# Altium schematic sheet clone_Schematics.SchDoc (part 2 of 2)
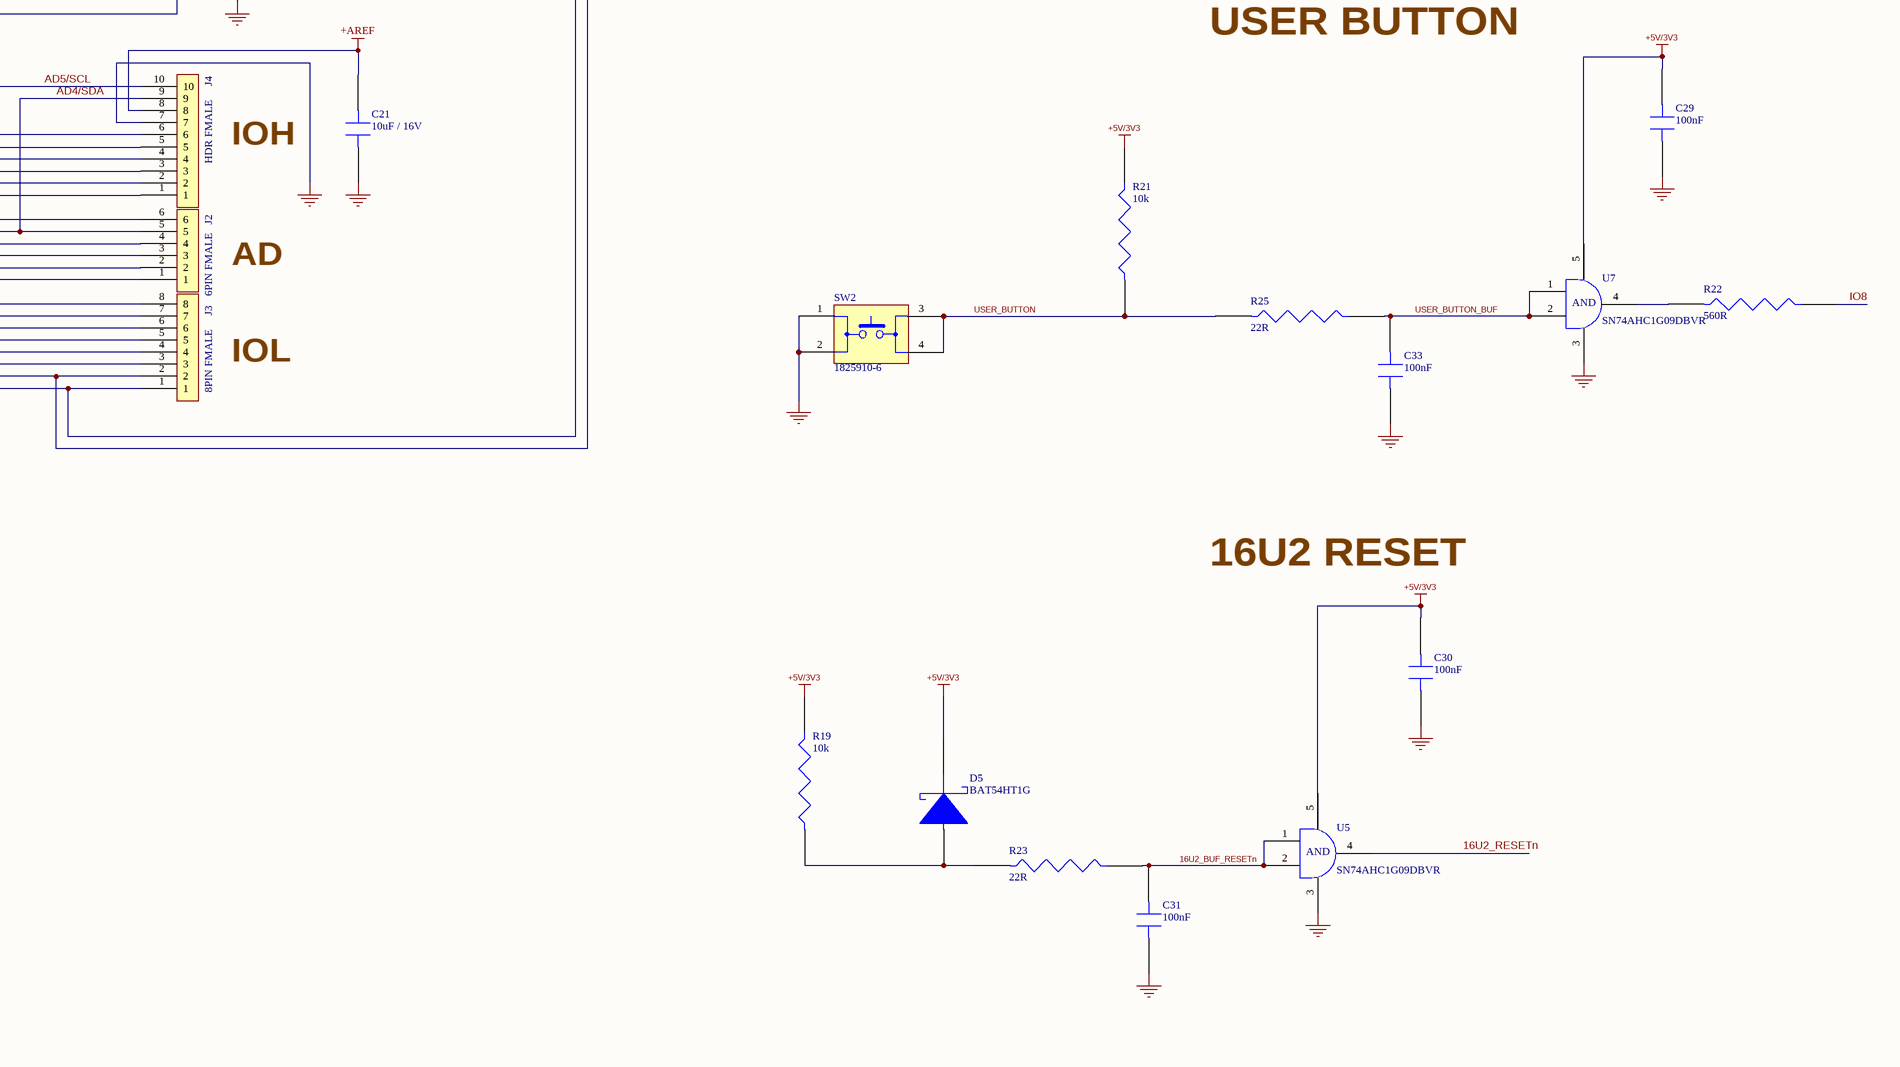
[diagram p4: clone_Schematics.SchDoc, bottom right]

## Library data of the parts
C1 C2 = EEE-1AA101WR: Aluminum Electrolytic Capacitor, 100 uF, 10 V, ± 20%, 1000 hours @ 85°C, Radial Can - SMD; Manufacturer: Panasonic; Capacitance: 100uF; Ripple Current: 50mA; Dissipation Factor: 30%; Leakage Current: 10uA; Supplier 1: Future Electronics; Manufacturer Part Number: EEE-1AA101WR; RoHS: Yes; Category: Aluminum Electrolytic Capacitors; Stock 1: 224000; Pricing 1: 1000=0.0636, 3000=0.062, 5000=0.0612, 20000=0.0592, 30000=0.0579 (USD); Mount: Surface Mount,PCB; Case/Package: Radial; Min Operating Temperature: -40°C; Max Operating Temperature: 85°C; Voltage Rating: 10V; Tolerance: 20%; Packaging: Tape and Reel; Package Quantity: 1000; Ripple Current (AC): 50mA; Voltage Rating (DC): 10V; Termination: SMD/SMT; Life (Hours): 1000Hour; Series: S; Construction: Cylindrical; Diameter: 5mm; Length: 5.5mm; Height: 5.4mm; Ratings: AEC-Q200; Radiation Hardening: No; Lead Free: Lead Free; RoHS Compliant: Yes; Reach SVHC Compliant: Unknown; ComponentLink1URL: https://datasheet.ciiva.com/26945/getdatasheetpartid-169213-26945071.pdf?src-supplier=Verical; ComponentLink1Description: https://datasheet.ciiva.com/26945/getdatasheetpartid-169213-26945071.pdf?src-supplier=Verical; ComponentLink2URL: https://datasheet.ciiva.com/24027/aba0000ce2-40801-24027541.pdf?src-supplier=Mouser; ComponentLink2Description: https://datasheet.ciiva.com/24027/aba0000ce2-40801-24027541.pdf?src-supplier=Mouser; ComponentLink3URL: https://datasheet.ciiva.com/14598/70255710-14598233.pdf?src-supplier=Allied+Electronics; ComponentLink3Description: https://datasheet.ciiva.com/14598/70255710-14598233.pdf?src-supplier=Allied+Electronics; ComponentLink4URL: https://datasheet.ciiva.com/14605/70255710-14605689.pdf?src-supplier=Allied+Electronics; ComponentLink4Description: https://datasheet.ciiva.com/14605/70255710-14605689.pdf?src-supplier=Allied+Electronics; ComponentLink5URL: https://datasheet.ciiva.com/11673/aba0000ce2-11673882.pdf?src-supplier=Avnet; ComponentLink5Description: https://datasheet.ciiva.com/11673/aba0000ce2-11673882.pdf?src-supplier=Avnet; ComponentLink6URL: https://datasheet.ciiva.com/16427/aba0000ce2-16427544.pdf?src-supplier=Future+Electronics; ComponentLink6Description: https://datasheet.ciiva.com/16427/aba0000ce2-16427544.pdf?src-supplier=Future+Electronics; Supplier Part Number 1: 4028584
C3 C12 C13 C19 C21 C22 C34 = CAP2
C4-C6 C8 C11 C14-C17 C20 C23 C24 C26 C28-C33 = C2012X7R1H104K085AA: Multilayer Ceramic Capacitor, 0.1 uF, 50 V, ± 10%, X7R, 0805 [2012 Metric]; Manufacturer: TDK; Voltage Rating: 50V; Supplier 1: Digikey; Manufacturer Part Number: C2012X7R1H104K085AA; RoHS: Yes; Category: Ceramic Capacitors; Stock 1: 1434801; Pricing 1: 1=0.13, 10=0.071, 50=0.0492, 100=0.0424, 500=0.03106, 1000=0.02754 (USD); Mount: Surface Mount; Case/Package: 0805; Number of Pins: 2; Case Code (Metric): 2012; Case Code (Imperial): 0805; Min Operating Temperature: -55°C; Max Operating Temperature: 125°C; Capacitance: 100nF; Tolerance: 10%; Packaging: Tape and Reel; Dielectric: X7R; Package Quantity: 1; Termination: SMD/SMT; Voltage: 50V; Series: C; Length: 2mm; Width: 0.049inch; Height: 0.85mm; Depth: 1.25mm; Thickness: 0.037inch; RoHS Compliant: Yes; Reach SVHC Compliant: No; Lead Free: Lead Free; ComponentLink1URL: https://datasheet.ciiva.com/11788/0900766b80c1bb00-11788128.pdf?src-supplier=Rs; ComponentLink1Description: https://datasheet.ciiva.com/11788/0900766b80c1bb00-11788128.pdf?src-supplier=Rs; ComponentLink2URL: https://datasheet.ciiva.com/6250/tdkmlcccaprange-6250821.pdf?src-supplier=Digikey; ComponentLink2Description: https://datasheet.ciiva.com/6250/tdkmlcccaprange-6250821.pdf?src-supplier=Digikey; ComponentLink3URL: https://datasheet.ciiva.com/6250/tdkmlcccaprange-6250824.pdf?src-supplier=Digikey; ComponentLink3Description: https://datasheet.ciiva.com/6250/tdkmlcccaprange-6250824.pdf?src-supplier=Digikey; ComponentLink4URL: https://datasheet.ciiva.com/23803/1796654-23803035.pdf?src-supplier=Newark; ComponentLink4Description: https://datasheet.ciiva.com/23803/1796654-23803035.pdf?src-supplier=Newark; ComponentLink5URL: https://datasheet.ciiva.com/28602/1571323-28602204.pdf?src-supplier=Element14; ComponentLink5Description: https://datasheet.ciiva.com/28602/1571323-28602204.pdf?src-supplier=Element14; ComponentLink6URL: https://datasheet.ciiva.com/24191/e412-c-24191447.pdf?src-supplier=Future+Electronics; ComponentLink6Description: https://datasheet.ciiva.com/24191/e412-c-24191447.pdf?src-supplier=Future+Electronics; Supplier Part Number 1: 445-7534-1-ND
C7 = C2012X5R1E105K125AA: CAP CER 1UF 25V X5R 0805; Manufacturer: TDK; Supplier 1: Rs; Manufacturer Part Number: C2012X5R1E105K125AA; RoHS: Yes; Category: Ceramic Capacitors; Stock 1: 1850; ComponentLink1URL: https://datasheet.ciiva.com/11787/0900766b80c1bb00-11787608.pdf?src-supplier=Rs; ComponentLink1Description: https://datasheet.ciiva.com/11787/0900766b80c1bb00-11787608.pdf?src-supplier=Rs; ComponentLink2URL: https://datasheet.ciiva.com/16449/e412-c-16449595.pdf?src-supplier=Future+Electronics; ComponentLink2Description: https://datasheet.ciiva.com/16449/e412-c-16449595.pdf?src-supplier=Future+Electronics; ComponentLink3URL: https://datasheet.ciiva.com/15192/getdatasheetpartid-726707-15192140.pdf?src-supplier=Verical; ComponentLink3Description: https://datasheet.ciiva.com/15192/getdatasheetpartid-726707-15192140.pdf?src-supplier=Verical; ComponentLink4URL: https://datasheet.ciiva.com/28602/1744655-28602171.pdf?src-supplier=Element14; ComponentLink4Description: https://datasheet.ciiva.com/28602/1744655-28602171.pdf?src-supplier=Element14; Supplier Part Number 1: 2427392P
C9 C10 C25 C27 = C0805C180J5TACTU: Cap Cer 0805 18PF 50VDC X8G 5%; Manufacturer: KEMET; Supplier 1: Digikey; Manufacturer Part Number: C0805C180J5TACTU; RoHS: Yes; Pricing 1: 16000=0.01394 (USD); RoHS Compliant: 5897YesNo; Supplier Part Number 1: 399-C0805C180J5TACTUTR-ND
D1 = LGL29K-G2J1-24-Z: LED Uni-Color Green 572nm Automotive 2-Pin Chip 0603(1608Metric) T/R; Manufacturer: Osram Opto; Lens Color: White; Forward Current: 20mA; Forward Voltage: 2.2V; Luminous Intensity: 5.6mcd; Viewing Angle: 160°; Lens Style: Flat,Diffused,Colorless,Rectangular; Test Current: 2mA; Dominant Wavelength: 570nm; Luminous Flux: 0.012lm; Number of LEDs: 1; Lens Transparency: Diffused; Reverse Voltage: 12V; Lens Size: 0.8mm; Supplier 1: Arrow Electronics; Manufacturer Part Number: LGL29K-G2J1-24-Z; RoHS: Yes; Category: LEDs; Stock 1: 160000; Pricing 1: 5000=0.0794, 10000=0.0725, 20000=0.0718, 25000=0.0689, 30000=0.0669, 50000=0.0624 (USD); Mount: Surface Mount; Case/Package: 0603; Number of Pins: 2; Color: Green; Case Code (Metric): 1608; Case Code (Imperial): 0603; Min Operating Temperature: -40°C; Max Operating Temperature: 100°C; Illumination Color: Green; Packaging: Tape and Reel; Package Quantity: 5000; Number of Elements: 1; Series: SMARTLED® 0603; Length: 1.3mm; Width: 0.8mm; Height: 0.65mm; Depth: 0.8mm; Radiation Hardening: No; RoHS Compliant: Yes; ComponentLink1URL: https://datasheet.ciiva.com/4689/g-l29k-39844-4689584.pdf?src-supplier=Mouser; ComponentLink1Description: https://datasheet.ciiva.com/4689/g-l29k-39844-4689584.pdf?src-supplier=Mouser; ComponentLink2URL: https://datasheet.ciiva.com/2112/00077107-0-2112887.pdf?src-supplier=Digikey; ComponentLink2Description: https://datasheet.ciiva.com/2112/00077107-0-2112887.pdf?src-supplier=Digikey; ComponentLink3URL: https://datasheet.ciiva.com/2112/00077107-0-2112886.pdf?src-supplier=Digikey; ComponentLink3Description: https://datasheet.ciiva.com/2112/00077107-0-2112886.pdf?src-supplier=Digikey; ComponentLink4URL: https://datasheet.ciiva.com/2112/00077107-0-2112888.pdf?src-supplier=Digikey; ComponentLink4Description: https://datasheet.ciiva.com/2112/00077107-0-2112888.pdf?src-supplier=Digikey; Supplier Part Number 1: LGL29K-G2J1-24-Z
D2-D4 = LED
D5 D6 = BAT54HT1G: Small Signal Schottky Diode, Single, 30 V, 200 Ma, 800 Mv, 600 Ma, 150 C; Manufacturer: ON Semiconductor / Fairchild; Forward Current: 200mA; Max Reverse Current: 2uA; Recovery Time: 5ns; Max Repetitive Reverse Voltage (Vrrm): 30V; Peak Non-Repetitive Surge Current: 600mA; Forward Voltage: 800mV; Power Dissipation: 200mW; Capacitance: 10pF; Polarity: 4901Direction; Supplier 1: Rs; Manufacturer Part Number: BAT54HT1G; RoHS: Yes; Category: Schottky Diodes; Stock 1: 15630; Mount: Surface Mount; Number of Pins: 2; Contact Plating: Tin,Matte; Min Operating Temperature: -55°C; Max Operating Temperature: 150°C; Packaging: Tape and Reel; Package Quantity: 1; Average Rectified Current: 200mA; Reverse Recovery Time: 5ns; Max Forward Surge Current (Ifsm): 600mA; Max Reverse Voltage (DC): 30V; Reverse Voltage: 30V; Series: -; Max Surge Current: 600mA; Voltage Rating (DC): 30V; Current Rating: 200mA; Max Reverse Leakage Current: 2uA; Reverse Recovery Time-Max: 5ns; Breakdown Voltage: 30V; Output Current: 200mA; Length: 1.8mm; Width: 1.35mm; Height: 1mm; Radiation Hardening: No; RoHS Compliant: Yes; Reach SVHC Compliant: No; Lead Free: Lead Free; ComponentLink1URL: https://datasheet.ciiva.com/4714/bat54ht1-d-72881-4714706.pdf?src-supplier=Mouser; ComponentLink1Description: https://datasheet.ciiva.com/4714/bat54ht1-d-72881-4714706.pdf?src-supplier=Mouser; ComponentLink2URL: https://datasheet.ciiva.com/4452/bat54ht1g-104602-4452889.pdf?src-supplier=Mouser; ComponentLink2Description: https://datasheet.ciiva.com/4452/bat54ht1g-104602-4452889.pdf?src-supplier=Mouser; ComponentLink3URL: https://datasheet.ciiva.com/30479/0900766b811a63a9-30479442.pdf?src-supplier=Rs; ComponentLink3Description: https://datasheet.ciiva.com/30479/0900766b811a63a9-30479442.pdf?src-supplier=Rs; ComponentLink4URL: https://datasheet.ciiva.com/34301/806549-34301562.pdf?src-supplier=Jameco; ComponentLink4Description: https://datasheet.ciiva.com/34301/806549-34301562.pdf?src-supplier=Jameco; ComponentLink5URL: https://datasheet.ciiva.com/1240/1747983-1240762.pdf?src-supplier=Newark; ComponentLink5Description: https://datasheet.ciiva.com/1240/1747983-1240762.pdf?src-supplier=Newark; ComponentLink6URL: https://datasheet.ciiva.com/915/bat54ht1-d-915445.pdf?src-supplier=Digikey; ComponentLink6Description: https://datasheet.ciiva.com/915/bat54ht1-d-915445.pdf?src-supplier=Digikey; ComponentLink7URL: https://datasheet.ciiva.com/915/bat54ht1-d-915444.pdf?src-supplier=Digikey; ComponentLink7Description: https://datasheet.ciiva.com/915/bat54ht1-d-915444.pdf?src-supplier=Digikey; ComponentLink8URL: https://datasheet.ciiva.com/910/bat54ht1g-910499.pdf?src-supplier=Digikey; ComponentLink8Description: https://datasheet.ciiva.com/910/bat54ht1g-910499.pdf?src-supplier=Digikey; ComponentLink9URL: https://datasheet.ciiva.com/910/bat54ht1g-910498.pdf?src-supplier=Digikey; ComponentLink9Description: https://datasheet.ciiva.com/910/bat54ht1g-910498.pdf?src-supplier=Digikey; ComponentLink10URL: https://datasheet.ciiva.com/8294/bat54ht1-d-8294645.pdf?src-supplier=Avnet; ComponentLink10Description: https://datasheet.ciiva.com/8294/bat54ht1-d-8294645.pdf?src-supplier=Avnet; ComponentLink11URL: https://datasheet.ciiva.com/910/bat54ht1g-910497.pdf?src-supplier=Digikey; ComponentLink11Description: https://datasheet.ciiva.com/910/bat54ht1g-910497.pdf?src-supplier=Digikey; ComponentLink12URL: https://datasheet.ciiva.com/8303/bat54ht1g-8303645.pdf?src-supplier=Avnet; ComponentLink12Description: https://datasheet.ciiva.com/8303/bat54ht1g-8303645.pdf?src-supplier=Avnet; ComponentLink13URL: https://datasheet.ciiva.com/915/bat54ht1-d-915443.pdf?src-supplier=Digikey; ComponentLink13Description: https://datasheet.ciiva.com/915/bat54ht1-d-915443.pdf?src-supplier=Digikey; ComponentLink14URL: https://datasheet.ciiva.com/46429/1727620-46429206.pdf?src-supplier=Element14; ComponentLink14Description: https://datasheet.ciiva.com/46429/1727620-46429206.pdf?src-supplier=Element14; ComponentLink15URL: https://datasheet.ciiva.com/1180/bat54ht1-d-1180252.pdf?src-supplier=Element14; ComponentLink15Description: https://datasheet.ciiva.com/1180/bat54ht1-d-1180252.pdf?src-supplier=Element14; ComponentLink16URL: https://datasheet.ciiva.com/1180/bat54ht1-d-1180251.pdf?src-supplier=Element14; ComponentLink16Description: https://datasheet.ciiva.com/1180/bat54ht1-d-1180251.pdf?src-supplier=Element14; ComponentLink17URL: https://datasheet.ciiva.com/17020/bat54ht1g-17020445.pdf?src-supplier=Future+Electronics; ComponentLink17Description: https://datasheet.ciiva.com/17020/bat54ht1g-17020445.pdf?src-supplier=Future+Electronics; ComponentLink18URL: https://datasheet.ciiva.com/48686/001262925-da-01-en-diode-schottky-30v-bat54ht1g-sod-323-fsc-48686266.pdf?src-supplier=Conrad; ComponentLink18Description: https://datasheet.ciiva.com/48686/001262925-da-01-en-diode-schottky-30v-bat54ht1g-sod-323-fsc-48686266.pdf?src-supplier=Conrad; Supplier Part Number 1: 7737614P
FB1-FB3 = MPZ2012S601AT000: Ferrite Beads Multi-Layer Power 600Ohm 25% 100MHz 2A 100mOhm DCR 0805 T/R; Manufacturer: TDK; Core Material: 228ConductorMaterial; Impedance: 600R; DC Resistance (DCR): 100mR; Number of Lines: 1; Supplier 1: Digikey; Manufacturer Part Number: MPZ2012S601AT000; RoHS: Yes; Category: Ferrite Beads and Chips; Stock 1: 207332; Pricing 1: 1=0.12, 10=0.094, 25=0.0848, 50=0.0622, 100=0.0537, 250=0.0424, 500=0.03582, 1000=0.03016, 4000=0.02827, 8000=0.02639, 12000=0.0245, 28000=0.02422, 100000=0.02356 (USD); Mount: Surface Mount; Case/Package: 0805; Case Code (Metric): 2012; Case Code (Imperial): 0805; Min Operating Temperature: -55°C; Max Operating Temperature: 125°C; Packaging: Tape and Reel; Package Quantity: 1; Current Rating: 2A; Max DC Current: 2A; Series: MPZ; Max Current Rating: 2A; RMS Current (Irms): 2A; Series Resistance: 100mR; Test Frequency: 100MHz; Tolerance: 25%; Length: 0.079inch; Width: 0.049inch; Height: 0.041inch; Reach SVHC Compliant: No; Lead Free: Lead Free; RoHS Compliant: Yes; ComponentLink1URL: https://datasheet.ciiva.com/46634/beads-commercial-power-mpz-en-46634335.pdf?src-supplier=Digikey; ComponentLink1Description: https://datasheet.ciiva.com/46634/beads-commercial-power-mpz-en-46634335.pdf?src-supplier=Digikey; ComponentLink2URL: https://datasheet.ciiva.com/46634/beads-commercial-power-mpz-en-46634377.pdf?src-supplier=Digikey; ComponentLink2Description: https://datasheet.ciiva.com/46634/beads-commercial-power-mpz-en-46634377.pdf?src-supplier=Digikey; ComponentLink3URL: https://datasheet.ciiva.com/46634/beads-commercial-power-mpz-en-46634606.pdf?src-supplier=Digikey; ComponentLink3Description: https://datasheet.ciiva.com/46634/beads-commercial-power-mpz-en-46634606.pdf?src-supplier=Digikey; Supplier Part Number 1: 445-MPZ2012S601AT000CT-ND
J1 J3 = 8PIN
J2 = 6PIN
J4 = 10PIN
J5 J6 = 67997-106HLF: Conn Unshrouded Header HDR 6 POS 2.54mm Solder ST Top Entry Thru-Hole BergStik® Bulk; Manufacturer: Amphenol ICC / FCI; Supplier 1: Arrow Electronics; Manufacturer Part Number: 67997-106HLF; RoHS: No; Category: Headers and Wire Housings; Stock 1: 1120; Pricing 1: 1=0.6738 (USD); ComponentLink1URL: http://uk.rs-online.com/webdocs/1450/0900766b81450b8b.pdf?src-supplier=Rs; ComponentLink1Description: http://uk.rs-online.com/webdocs/1450/0900766b81450b8b.pdf?src-supplier=Rs; ComponentLink2URL: https://datasheet.octopart.com/67997-106HLF-Areva-datasheet-118652.pdf?src-supplier=Digikey; ComponentLink2Description: https://datasheet.octopart.com/67997-106HLF-Areva-datasheet-118652.pdf?src-supplier=Digikey; ComponentLink3URL: https://datasheet.octopart.com/67997-106HLF-Amphenol-Communications-Solutions-datasheet-36854132.pdf?src-supplier=Farnell; ComponentLink3Description: https://datasheet.octopart.com/67997-106HLF-Amphenol-Communications-Solutions-datasheet-36854132.pdf?src-supplier=Farnell; ComponentLink4URL: https://cdn.amphenol-icc.com/media/wysiwyg/files/drawing/67996.pdf?src-supplier=Mouser; ComponentLink4Description: https://cdn.amphenol-icc.com/media/wysiwyg/files/drawing/67996.pdf?src-supplier=Mouser; ComponentLink5URL: https://cdn.amphenol-icc.com/media/wysiwyg/files/drawing/67996.pdf?src-supplier=Avnet; ComponentLink5Description: https://cdn.amphenol-icc.com/media/wysiwyg/files/drawing/67996.pdf?src-supplier=Avnet; ComponentLink6URL: http://components.arrow.com/part/dataview/41913658S7633350N8314?src-supplier=Arrow+Electronics; ComponentLink6Description: http://components.arrow.com/part/dataview/41913658S7633350N8314?src-supplier=Arrow+Electronics; ComponentLink7URL: https://cdn.amphenol-icc.com/media/wysiwyg/files/drawing/67996.pdf?src-supplier=Onlinecomponents.com; ComponentLink7Description: https://cdn.amphenol-icc.com/media/wysiwyg/files/drawing/67996.pdf?src-supplier=Onlinecomponents.com; ComponentLink8URL: http://www.farnell.com/datasheets/1876884.pdf?src-supplier=Newark; ComponentLink8Description: http://www.farnell.com/datasheets/1876884.pdf?src-supplier=Newark; ComponentLink9URL: https://cdn.amphenol-icc.com/media/wysiwyg/files/drawing/67996.pdf?src-supplier=Allied+Electronics; ComponentLink9Description: https://cdn.amphenol-icc.com/media/wysiwyg/files/drawing/67996.pdf?src-supplier=Allied+Electronics; ComponentLink10URL: https://cdn.amphenol-icc.com/media/wysiwyg/files/drawing/67996.pdf?src-supplier=TTI; ComponentLink10Description: https://cdn.amphenol-icc.com/media/wysiwyg/files/drawing/67996.pdf?src-supplier=TTI; ComponentLink11URL: https://cdn.amphenol-icc.com/media/wysiwyg/files/drawing/67996.pdf?src-supplier=Heilind+Electronics; ComponentLink11Description: https://cdn.amphenol-icc.com/media/wysiwyg/files/drawing/67996.pdf?src-supplier=Heilind+Electronics; Supplier Part Number 1: 67997-106HLF
J7 = 101181930001LF: MICRO USB B0TYPE F-10118193-0001LF | Amphenol FCI (Amphenol CS) 101181930001LF; Manufacturer: Amphenol Communications Solutions; Supplier 1: Digikey; Manufacturer Part Number: 101181930001LF; RoHS: No; Category: Uncategorized; Stock 1: 190276; Pricing 1: 1=0.57, 10=0.43, 25=0.3864, 50=0.3566, 100=0.3293, 250=0.29696, 500=0.27504, 1200=0.24879, 2400=0.2326, 3600=0.22308, 6000=0.21184, 8400=0.20487, 12000=0.19785, 30000=0.18138 (USD); Supplier Part Number 1: 609-4616-1-ND
J8 J9 = PAD_WITH_HOLE: pad with hole
JP1 JP4 = 68000-103HLF: Conn Unshrouded Header HDR 3 POS 2.54mm Solder ST Top Entry Thru-Hole BergStik® Automotive Bulk; Manufacturer: Amphenol ICC / FCI; Supplier 1: Arrow Electronics; Manufacturer Part Number: 68000-103HLF; RoHS: No; Category: Headers and Wire Housings; Stock 1: 30; Pricing 1: 1=0.3226, 10=0.2231, 25=0.2208, 50=0.1898, 100=0.1562, 1000=0.1333 (USD); ComponentLink1URL: https://datasheet.ciiva.com/46392/1914865-46392021.pdf?src-supplier=Element14; ComponentLink1Description: https://datasheet.ciiva.com/46392/1914865-46392021.pdf?src-supplier=Element14; Supplier Part Number 1: 68000-103HLF
JP2 = 68602-204HLF: Conn Unshrouded Header HDR 4 POS 2.54mm Solder ST Top Entry Thru-Hole BergStik® Bulk; Manufacturer: Amphenol ICC / FCI; Number of Positions: 4; Current Rating: 3A; Insulation Resistance: 5GR; Voltage Rating: 1.5kV; Row Spacing: 0.1inch; Contact Post Length: 3.81mm; Supplier 1: Arrow Electronics; Manufacturer Part Number: 68602-204HLF; RoHS: No; Category: Connectors; Pricing 1: 2000=0.1295, 2500=0.1283, 3000=0.1271, 4000=0.1259, 5000=0.1247, 6000=0.1235, 10000=0.1223, 20000=0.121, 50000=0.1198 (USD); Mount: Through Hole; Contact Plating: Gold,GXT; Color: Black; Contact Material: Bronze; Housing Material: Thermoplastic; Min Operating Temperature: -65°C; Max Operating Temperature: 125°C; Series: BERGSTIK® II, MezzSelect™, Basics+; Packaging: Bulk; Contact Type: Male Pin; Number of Rows: 2; Termination: Solder; Contact Gender: Male; Package Quantity: 100; Number of Contacts: 4; Pitch: 2.54mm; Contact Mating Length: 0.23inch; Radiation Hardening: No; Flammability Rating: UL94 V-0; ComponentLink1URL: https://cdn.amphenol-icc.com/media/wysiwyg/files/drawing/67996.pdf?src-supplier=Digikey; ComponentLink1Description: https://cdn.amphenol-icc.com/media/wysiwyg/files/drawing/67996.pdf?src-supplier=Digikey; ComponentLink2URL: https://cdn.amphenol-icc.com/media/wysiwyg/files/drawing/67996.pdf?src-supplier=Allied+Electronics; ComponentLink2Description: https://cdn.amphenol-icc.com/media/wysiwyg/files/drawing/67996.pdf?src-supplier=Allied+Electronics; ComponentLink3URL: https://cdn.amphenol-icc.com/media/wysiwyg/files/drawing/67996.pdf?src-supplier=Mouser; ComponentLink3Description: https://cdn.amphenol-icc.com/media/wysiwyg/files/drawing/67996.pdf?src-supplier=Mouser; ComponentLink4URL: https://cdn.amphenol-icc.com/media/wysiwyg/files/drawing/67996.pdf?src-supplier=Avnet; ComponentLink4Description: https://cdn.amphenol-icc.com/media/wysiwyg/files/drawing/67996.pdf?src-supplier=Avnet; ComponentLink5URL: https://cdn.amphenol-icc.com/media/wysiwyg/files/drawing/67996.pdf?src-supplier=Heilind+Electronics; ComponentLink5Description: https://cdn.amphenol-icc.com/media/wysiwyg/files/drawing/67996.pdf?src-supplier=Heilind+Electronics; Supplier Part Number 1: 68602-204HLF
JP3 = 68001-204HLF: Conn Unshrouded Header HDR 4 POS 2.54mm Solder ST Thru-Hole Bag; Manufacturer: Amphenol ICC / FCI; Supplier 1: Digikey; Manufacturer Part Number: 68001-204HLF; RoHS: No; Category: Headers and Wire Housings; Stock 1: 3967; Pricing 1: 1=0.51, 10=0.388, 100=0.2643, 500=0.24106, 1000=0.19734, 5000=0.17678, 10000=0.17484 (USD); ComponentLink1URL: http://uk.rs-online.com/webdocs/1450/0900766b81450c68.pdf?src-supplier=Rs; ComponentLink1Description: http://uk.rs-online.com/webdocs/1450/0900766b81450c68.pdf?src-supplier=Rs; ComponentLink2URL: https://datasheet.octopart.com/68001-204HLF-Amphenol-Communications-Solutions-datasheet-100449246.pdf?src-supplier=Future+Electronics; ComponentLink2Description: https://datasheet.octopart.com/68001-204HLF-Amphenol-Communications-Solutions-datasheet-100449246.pdf?src-supplier=Future+Electronics; ComponentLink3URL: http://components.arrow.com/part/dataview/42735081S8853857N8314?src-supplier=Arrow+Electronics; ComponentLink3Description: http://components.arrow.com/part/dataview/42735081S8853857N8314?src-supplier=Arrow+Electronics; ComponentLink4URL: https://cdn.amphenol-icc.com/media/wysiwyg/files/drawing/68000.pdf?src-supplier=Digikey; ComponentLink4Description: https://cdn.amphenol-icc.com/media/wysiwyg/files/drawing/68000.pdf?src-supplier=Digikey; ComponentLink5URL: https://cdn.amphenol-icc.com/media/wysiwyg/files/drawing/68000.pdf?src-supplier=Mouser; ComponentLink5Description: https://cdn.amphenol-icc.com/media/wysiwyg/files/drawing/68000.pdf?src-supplier=Mouser; ComponentLink6URL: https://datasheet.octopart.com/68001-204HLF-Amphenol-Communications-Solutions-datasheet-41232361.pdf?src-supplier=Element14; ComponentLink6Description: https://datasheet.octopart.com/68001-204HLF-Amphenol-Communications-Solutions-datasheet-41232361.pdf?src-supplier=Element14; ComponentLink7URL: https://cdn.amphenol-icc.com/media/wysiwyg/files/drawing/68000.pdf?src-supplier=Allied+Electronics; ComponentLink7Description: https://cdn.amphenol-icc.com/media/wysiwyg/files/drawing/68000.pdf?src-supplier=Allied+Electronics; ComponentLink8URL: https://cdn.amphenol-icc.com/media/wysiwyg/files/drawing/68000.pdf?src-supplier=Avnet; ComponentLink8Description: https://cdn.amphenol-icc.com/media/wysiwyg/files/drawing/68000.pdf?src-supplier=Avnet; ComponentLink9URL: https://cdn.amphenol-icc.com/media/wysiwyg/files/drawing/68000.pdf?src-supplier=TTI; ComponentLink9Description: https://cdn.amphenol-icc.com/media/wysiwyg/files/drawing/68000.pdf?src-supplier=TTI; ComponentLink10URL: https://cdn.amphenol-icc.com/media/wysiwyg/files/drawing/68000.pdf?src-supplier=Heilind+Electronics; ComponentLink10Description: https://cdn.amphenol-icc.com/media/wysiwyg/files/drawing/68000.pdf?src-supplier=Heilind+Electronics; ComponentLink11URL: https://datasheet.octopart.com/68001-204HLF-Amphenol-Communications-Solutions-datasheet-154727322.pdf?src-supplier=Master+Electronics; ComponentLink11Description: https://datasheet.octopart.com/68001-204HLF-Amphenol-Communications-Solutions-datasheet-154727322.pdf?src-supplier=Master+Electronics; Supplier Part Number 1: 609-3402-ND
L1 = inductor
LINK1-LINK3 = QPC02SXGN-RC: 2 Position 2.54 mm Centerline Single Circuit Open Top Jumper; Manufacturer: Sullins; Current Rating: 3A; Number of Contacts: 2NUMBER; Supplier 1: Digikey; Manufacturer Part Number: QPC02SXGN-RC; RoHS: Yes; Category: Connectors; Stock 1: 381152; Pricing 1: 1=0.1, 10=0.05, 25=0.0416, 50=0.0382, 100=0.0369, 250=0.03184, 500=0.03058, 2000=0.02548, 4000=0.02421 (USD); Contact Material: 157ConductorMaterial; Min Operating Temperature: -40°C; Max Operating Temperature: 85°C; Lead Free: 5697LeadFree; ComponentLink1URL: https://datasheet.ciiva.com/767/284-sxgn-11510-767869.pdf?src-supplier=Digikey; ComponentLink1Description: https://datasheet.ciiva.com/767/284-sxgn-11510-767869.pdf?src-supplier=Digikey; Supplier Part Number 1: S9337-ND
MH1-MH3 = mounting hole 7.4mm C3.2: MH 7.4 mm Dia 3.2mm Drill
MH4 = mounting hole nonplated: mounting hole nonplated 7.4x3.2 non copper
R1 = RC0805JR-07100KL: SMD Chip Resistor, 100 kOhm, ï¿½ 5%, 125 mW, 0805 [2012 Metric], Thick Film, General Purpose; Manufacturer: Yageo; Voltage Rating (AC): 150V; Supplier 1: Rs; Manufacturer Part Number: RC0805JR-07100KL; RoHS: Yes; Category: Chip SMD Resistors; Stock 1: 4600; Lead Free: 5697LeadFree; ComponentLink1URL: https://datasheet.ciiva.com/15190/getdatasheetpartid-479267-15190029.pdf?src-supplier=Verical; ComponentLink1Description: https://datasheet.ciiva.com/15190/getdatasheetpartid-479267-15190029.pdf?src-supplier=Verical; ComponentLink2URL: https://datasheet.ciiva.com/7941/442941-7941864.pdf?src-supplier=Element14; ComponentLink2Description: https://datasheet.ciiva.com/7941/442941-7941864.pdf?src-supplier=Element14; ComponentLink3URL: https://datasheet.ciiva.com/7941/442941-7941865.pdf?src-supplier=Element14; ComponentLink3Description: https://datasheet.ciiva.com/7941/442941-7941865.pdf?src-supplier=Element14; Supplier Part Number 1: 1995755
R2 R3 R15 R17 R22 = RC0805FR-07560RL: Res General Purpose Thick Film 0805 560 Ohm 1% 1/8W ±100ppm/°C Molded Paper T/R; Manufacturer: Yageo; Supplier 1: Rs; Manufacturer Part Number: RC0805FR-07560RL; RoHS: Yes; Category: Chip SMD Resistors; Stock 1: 8800; Supplier Part Number 1: 1995728
R4 R14 R18-R21 = RC0805FR-0710KL: SMD Chip Resistor, 10 kOhm, ï¿½ 1%, 125 mW, 0805 [2012 Metric], Thick Film, General Purpose; Manufacturer: Yageo; Resistance: 10kR; Temperature Coefficient: 100ppm/°C; Power Rating: 125mW; Voltage Rating: 150V; Supplier 1: Rs; Manufacturer Part Number: RC0805FR-0710KL; RoHS: Yes; Category: Chip SMD Resistors; Stock 1: 250000; Case/Package: 0805; Case Code (Imperial): 0805; Case Code (Metric): 2012; Size Code: 0805; Min Operating Temperature: -55°C; Max Operating Temperature: 155°C; Tolerance: 1%; Packaging: Tape and Reel; Resistor Type: Thick Film; Package Quantity: 1; Termination: SMD/SMT; Number of Terminations: 2; Max Power Dissipation: 125mW; Features: Moisture Resistant; Series: RC; Construction: Rectangular; Resistance Tolerance: 1%; Technology: THICK FILM; Voltage Rating (AC): 150V; Length: 0.079inch; Width: 0.049inch; Height: 0.024inch; Depth: 1.25mm; Reach SVHC Compliant: Unknown; Lead Free: Lead Free; Military Standard: Not; RoHS Compliant: Yes; Supplier Part Number 1: 6185163
R5-R7 R13 R23-R25 = RC0805FR-0722RL: SMD Chip Resistor, 22 Ohm, ± 1%, 125 mW, 0805 [2012 Metric], Thick Film, General Purpose; Manufacturer: Yageo; Voltage Rating (AC): 150V; Supplier 1: Rs; Manufacturer Part Number: RC0805FR-0722RL; RoHS: Yes; Category: Chip SMD Resistors; Stock 1: 9200; Lead Free: 5697LeadFree; ComponentLink1URL: https://datasheet.ciiva.com/11819/0900766b8106beab-11819837.pdf?src-supplier=Rs; ComponentLink1Description: https://datasheet.ciiva.com/11819/0900766b8106beab-11819837.pdf?src-supplier=Rs; ComponentLink2URL: https://datasheet.ciiva.com/2457/pyu-r-int-thick-7-2457045.pdf?src-supplier=Digikey; ComponentLink2Description: https://datasheet.ciiva.com/2457/pyu-r-int-thick-7-2457045.pdf?src-supplier=Digikey; ComponentLink3URL: https://datasheet.ciiva.com/2457/pyu-r-int-thick-7-2457046.pdf?src-supplier=Digikey; ComponentLink3Description: https://datasheet.ciiva.com/2457/pyu-r-int-thick-7-2457046.pdf?src-supplier=Digikey; ComponentLink4URL: https://datasheet.ciiva.com/12667/rc0805-12667371.pdf?src-supplier=Mouser; ComponentLink4Description: https://datasheet.ciiva.com/12667/rc0805-12667371.pdf?src-supplier=Mouser; ComponentLink5URL: https://datasheet.ciiva.com/2457/pyu-r-int-thick-7-2457044.pdf?src-supplier=Digikey; ComponentLink5Description: https://datasheet.ciiva.com/2457/pyu-r-int-thick-7-2457044.pdf?src-supplier=Digikey; ComponentLink6URL: https://datasheet.ciiva.com/46447/444164-46447574.pdf?src-supplier=Element14; ComponentLink6Description: https://datasheet.ciiva.com/46447/444164-46447574.pdf?src-supplier=Element14; Supplier Part Number 1: 2426945
R8 R26-R28 = 0Ohm Resistor
R9 R16 = RC0805FR-071ML: SMD Chip Resistor, 1 MOhm, ï¿½ 1%, 125 mW, 0805 [2012 Metric], Thick Film, General Purpose; Manufacturer: Yageo; Resistance: 1MR; Temperature Coefficient: 250ppm/°C; Power Rating: 125mW; Voltage Rating: 150V; Supplier 1: Rs; Manufacturer Part Number: RC0805FR-071ML; RoHS: Yes; Category: Chip SMD Resistors; Stock 1: 8800; Case/Package: Molded; Case Code (Metric): 2012; Case Code (Imperial): 0805; Size Code: 0805; Min Operating Temperature: -55°C; Max Operating Temperature: 155°C; Tolerance: 1%; Resistor Type: Thick Film; Packaging: Tape and Reel; Construction: Rectangular; Resistance Tolerance: 1%; Voltage Rating (AC): 150V; Length: 2mm; Depth: 1.25mm; Lead Free: Lead Free; Reach SVHC Compliant: Unknown; RoHS Compliant: Yes; Military Standard: Not; Supplier Part Number 1: 2426927
R10-R12 = RC0805FR-071KL: SMD Chip Resistor, 1 kOhm, ï¿½ 1%, 125 mW, 0805 [2012 Metric], Thick Film, General Purpose; Manufacturer: Yageo; Resistance: 1kR; Power Rating: 125mW; Voltage Rating (DC): 150V; Temperature Coefficient: 100ppm/°C; Supplier 1: Rs; Manufacturer Part Number: RC0805FR-071KL; RoHS: Yes; Category: Chip SMD Resistors; Stock 1: 900; Case/Package: 0805; Number of Pins: 2; Case Code (Metric): 2012; Case Code (Imperial): 0805; Size Code: 0805; Min Operating Temperature: -55°C; Max Operating Temperature: 155°C; Tolerance: 1%; Packaging: Tape and Reel; Package Quantity: 1; Voltage Rating: 150V; Resistor Type: Thick Film; Number of Terminations: 2; Termination: SMD/SMT; Max Power Dissipation: 125mW; Features: Moisture Resistant; Series: RC; Resistance Tolerance: 1%; Construction: Rectangular; Voltage Rating (AC): 150V; Length: 0.079inch; Width: 0.049inch; Height: 0.024inch; Depth: 1.25mm; Reach SVHC Compliant: No; Lead Free: 5697LeadFree; Military Standard: Not; RoHS Compliant: Yes; ComponentLink1URL: https://datasheet.ciiva.com/7941/1686128-7941719.pdf?src-supplier=Element14; ComponentLink1Description: https://datasheet.ciiva.com/7941/1686128-7941719.pdf?src-supplier=Element14; ComponentLink2URL: https://datasheet.ciiva.com/46385/444164-46385020.pdf?src-supplier=Element14; ComponentLink2Description: https://datasheet.ciiva.com/46385/444164-46385020.pdf?src-supplier=Element14; ComponentLink3URL: https://datasheet.ciiva.com/2456/pyu-r-int-thick-7-2456976.pdf?src-supplier=Digikey; ComponentLink3Description: https://datasheet.ciiva.com/2456/pyu-r-int-thick-7-2456976.pdf?src-supplier=Digikey; ComponentLink4URL: https://datasheet.ciiva.com/2456/pyu-r-int-thick-7-2456977.pdf?src-supplier=Digikey; ComponentLink4Description: https://datasheet.ciiva.com/2456/pyu-r-int-thick-7-2456977.pdf?src-supplier=Digikey; ComponentLink5URL: https://datasheet.ciiva.com/2456/pyu-r-int-thick-7-2456975.pdf?src-supplier=Digikey; ComponentLink5Description: https://datasheet.ciiva.com/2456/pyu-r-int-thick-7-2456975.pdf?src-supplier=Digikey; Supplier Part Number 1: 2426923
SCKT_FOR_U1 = 4828-3004-CP: Socket DIP 28Cnts DualWipe 0.3InSpc. PhosphorBronze Nickel KinkedTail 4800Series | 3M 4828-3004-CP; Supplier 1: Digikey; Manufacturer: 3M; Manufacturer Part Number: 4828-3004-CP; RoHS: Yes; Category: Connectors; Stock 1: 11258; Pricing 1: 1=1.06, 14=0.89571, 28=0.85893, 56=0.84071, 112=0.80411, 252=0.73103, 504=0.65794, 1008=0.58483, 2506=0.53 (USD); ComponentLink1URL: https://datasheet.ciiva.com/768/ts1099-768354.pdf?src-supplier=Digikey; ComponentLink1Description: https://datasheet.ciiva.com/768/ts1099-768354.pdf?src-supplier=Digikey; Supplier Part Number 1: 3M5480-ND
SW1 SW2 = 2-1825910-6: Switch Tactile OFF (ON) SPST Extended Round Button PC Pins 0.05A 24VDC 100000Cycles 1.57N Thru-Hole Loose; Manufacturer: TE Connectivity AMP; Supplier 1: Avnet; Manufacturer Part Number: 2-1825910-6; RoHS: Yes; Category: Pushbutton Switches; Stock 1: 161; Pricing 1: 1=0.236, 30=0.22, 100=0.205, 500=0.176, 1000=0.132 (USD); ComponentLink1URL: https://datasheet.octopart.com/2-1825910-6-TE-Connectivity-datasheet-10294628.pdf?src-supplier=Farnell; ComponentLink1Description: https://datasheet.octopart.com/2-1825910-6-TE-Connectivity-datasheet-10294628.pdf?src-supplier=Farnell; ComponentLink2URL: https://datasheet.octopart.com/FSM14JLH-TE-Connectivity-datasheet-65851110.pdf?src-supplier=Element14; ComponentLink2Description: https://datasheet.octopart.com/FSM14JLH-TE-Connectivity-datasheet-65851110.pdf?src-supplier=Element14; ComponentLink3URL: https://www.te.com/commerce/DocumentDelivery/DDEController?Action=srchrtrv&DocNm=1825910&DocType=Customer+Drawing&DocLang=English&src-supplier=Digikey; ComponentLink3Description: https://www.te.com/commerce/DocumentDelivery/DDEController?Action=srchrtrv&DocNm=1825910&DocType=Customer+Drawing&DocLang=English&src-supplier=Digikey; ComponentLink4URL: https://datasheet.octopart.com/2-1825910-6-TE-Connectivity-datasheet-41520022.pdf?src-supplier=Future+Electronics; ComponentLink4Description: https://datasheet.octopart.com/2-1825910-6-TE-Connectivity-datasheet-41520022.pdf?src-supplier=Future+Electronics; ComponentLink5URL: https://datasheet.octopart.com/FSM14JLH-TE-Connectivity---Alcoswitch-datasheet-154803662.pdf?src-supplier=Master+Electronics; ComponentLink5Description: https://datasheet.octopart.com/FSM14JLH-TE-Connectivity---Alcoswitch-datasheet-154803662.pdf?src-supplier=Master+Electronics; ComponentLink6URL: https://datasheet.octopart.com/2-1825910-6-TE-Connectivity-datasheet-140803306.pdf?src-supplier=TME; ComponentLink6Description: https://datasheet.octopart.com/2-1825910-6-TE-Connectivity-datasheet-140803306.pdf?src-supplier=TME; Supplier Part Number 1: 95Y0237
U1 = ATMEGA328P-PU: Microchip - ATMEGA328P-PU - Microcontroller Mcu, 8 Bit, Atmega, 20MHZ, DIP-28; RAM Size: 2KB; Number of PWM Channels: 6; Number of Timers/Counters: 3; Min Supply Voltage: 1.8V; Max Supply Voltage: 5.5V; Interface: I2C; Number of I/Os: 23; Oscillator Type: Internal; Data Bus Width: 8b; Number of SPI Channels: 1; Memory Type: FLASH; Memory Size: 32KB; Peripherals: Brown-out Detect/Reset; Core Architecture: AVR; Supplier 1: Farnell; Manufacturer: Microchip; Manufacturer Part Number: ATMEGA328P-PU; Category: Microcontrollers; Stock 1: 25444; Mount: Through Hole; Case/Package: PDIP; Number of Pins: 28; Weight: 0.077603oz; Min Operating Temperature: -40°C; Max Operating Temperature: 85°C; Number of ADC Channels: 6; Packaging: Rail/Tube; Frequency: 20MHz; Package Quantity: 14; Max Frequency: 20MHz; Number of I2C Channels: 1; Series: ATmega328P; Length: 34.8mm; Width: 7.49mm; Height: 4.57mm; Radiation Hardening: No; RoHS Compliant: Yes; Lead Free: 5697LeadFree; Reach SVHC Compliant: No; ComponentLink1URL: https://datasheet.ciiva.com/19457/2139111-19457070.pdf?src-supplier=Jameco; ComponentLink1Description: https://datasheet.ciiva.com/19457/2139111-19457070.pdf?src-supplier=Jameco; ComponentLink2URL: https://datasheet.ciiva.com/1157/1684409-1157696.pdf?src-supplier=Element14; ComponentLink2Description: https://datasheet.ciiva.com/1157/1684409-1157696.pdf?src-supplier=Element14; ComponentLink3URL: https://datasheet.ciiva.com/29119/155197-da-01-en-microcontr-atmega328p-pu-8bit-pdip-28-29119593.pdf?src-supplier=Conrad; ComponentLink3Description: https://datasheet.ciiva.com/29119/155197-da-01-en-microcontr-atmega328p-pu-8bit-pdip-28-29119593.pdf?src-supplier=Conrad; ComponentLink4URL: https://datasheet.ciiva.com/15213/getdatasheetpartid-318533-15213133.pdf?src-supplier=Verical; ComponentLink4Description: https://datasheet.ciiva.com/15213/getdatasheetpartid-318533-15213133.pdf?src-supplier=Verical; ComponentLink5URL: https://datasheet.octopart.com/ATMEGA328P-PU-Atmel-datasheet-34147914.pdf?src-supplier=Upverter; ComponentLink5Description: https://datasheet.octopart.com/ATMEGA328P-PU-Atmel-datasheet-34147914.pdf?src-supplier=Upverter; ComponentLink6URL: https://datasheet.octopart.com/ATMEGA328P-PU-Microchip-datasheet-14421303.pdf?src-supplier=Upverter; ComponentLink6Description: https://datasheet.octopart.com/ATMEGA328P-PU-Microchip-datasheet-14421303.pdf?src-supplier=Upverter; ComponentLink7URL: https://datasheet.octopart.com/ATMEGA328P-PU-Atmel-datasheet-14353408.pdf?src-supplier=Upverter; ComponentLink7Description: https://datasheet.octopart.com/ATMEGA328P-PU-Atmel-datasheet-14353408.pdf?src-supplier=Upverter; ComponentLink8URL: https://datasheet.octopart.com/ATMEGA328P-PU-Microchip-datasheet-68295846.pdf?src-supplier=SHENGYU+ELECTRONICS; ComponentLink8Description: https://datasheet.octopart.com/ATMEGA328P-PU-Microchip-datasheet-68295846.pdf?src-supplier=SHENGYU+ELECTRONICS; ComponentLink9URL: https://datasheet.octopart.com/ATMEGA328P-PU-Microchip-datasheet-133520744.pdf?src-supplier=LKR; ComponentLink9Description: https://datasheet.octopart.com/ATMEGA328P-PU-Microchip-datasheet-133520744.pdf?src-supplier=LKR; ComponentLink10URL: https://datasheet.octopart.com/ATMEGA328P-PU-Microchip-datasheet-62316222.pdf?src-supplier=Element14; ComponentLink10Description: https://datasheet.octopart.com/ATMEGA328P-PU-Microchip-datasheet-62316222.pdf?src-supplier=Element14; ComponentLink11URL: https://datasheet.octopart.com/ATMEGA328P-PU-Atmel-datasheet-13381135.pdf?src-supplier=Element14; ComponentLink11Description: https://datasheet.octopart.com/ATMEGA328P-PU-Atmel-datasheet-13381135.pdf?src-supplier=Element14; ComponentLink12URL: https://datasheet.octopart.com/ATMEGA328P-PU-Microchip-datasheet-147334532.pdf?src-supplier=microchipDIRECT; ComponentLink12Description: https://datasheet.octopart.com/ATMEGA328P-PU-Microchip-datasheet-147334532.pdf?src-supplier=microchipDIRECT; ComponentLink13URL: https://datasheet.octopart.com/ATMEGA328P-PU-Microchip-datasheet-148646239.pdf?src-supplier=microchipDIRECT; ComponentLink13Description: https://datasheet.octopart.com/ATMEGA328P-PU-Microchip-datasheet-148646239.pdf?src-supplier=microchipDIRECT; ComponentLink14URL: https://datasheet.octopart.com/ATMEGA328P-PU-Microchip-datasheet-154741723.pdf?src-supplier=Electro+Sonic; ComponentLink14Description: https://datasheet.octopart.com/ATMEGA328P-PU-Microchip-datasheet-154741723.pdf?src-supplier=Electro+Sonic; ComponentLink15URL: https://datasheet.octopart.com/ATMEGA328P-PU-Microchip-datasheet-100453898.pdf?src-supplier=Burklin+Elektronik; ComponentLink15Description: https://datasheet.octopart.com/ATMEGA328P-PU-Microchip-datasheet-100453898.pdf?src-supplier=Burklin+Elektronik; ComponentLink16URL: https://datasheet.octopart.com/ATMEGA328P-PU-Atmel-datasheet-30457899.pdf?src-supplier=Seeed+Studio; ComponentLink16Description: https://datasheet.octopart.com/ATMEGA328P-PU-Atmel-datasheet-30457899.pdf?src-supplier=Seeed+Studio; ComponentLink17URL: https://datasheet.octopart.com/ATMEGA328P-PU-Microchip-datasheet-10842036.pdf?src-supplier=SOS+electronic; ComponentLink17Description: https://datasheet.octopart.com/ATMEGA328P-PU-Microchip-datasheet-10842036.pdf?src-supplier=SOS+electronic; ComponentLink18URL: https://datasheet.octopart.com/ATMEGA328P-PU-Microchip-datasheet-8364063.pdf?src-supplier=Jameco; ComponentLink18Description: https://datasheet.octopart.com/ATMEGA328P-PU-Microchip-datasheet-8364063.pdf?src-supplier=Jameco; ComponentLink19URL: https://datasheet.octopart.com/ATMEGA328P-PU-Microchip-datasheet-154323124.pdf?src-supplier=Jameco; ComponentLink19Description: https://datasheet.octopart.com/ATMEGA328P-PU-Microchip-datasheet-154323124.pdf?src-supplier=Jameco; ComponentLink20URL: https://datasheet.octopart.com/ATMEGA328P-PU-Atmel-datasheet-10389530.pdf?src-supplier=Newark; ComponentLink20Description: https://datasheet.octopart.com/ATMEGA328P-PU-Atmel-datasheet-10389530.pdf?src-supplier=Newark; ComponentLink21URL: https://datasheet.octopart.com/ATMEGA328P-PU-Microchip-datasheet-65729177.pdf?src-supplier=TME; ComponentLink21Description: https://datasheet.octopart.com/ATMEGA328P-PU-Microchip-datasheet-65729177.pdf?src-supplier=TME; ComponentLink22URL: https://datasheet.octopart.com/ATMEGA328P-PU-Microchip-datasheet-101746195.pdf?src-supplier=Future+Electronics; ComponentLink22Description: https://datasheet.octopart.com/ATMEGA328P-PU-Microchip-datasheet-101746195.pdf?src-supplier=Future+Electronics; Supplier Part Number 1: ATMEGA328P-PU
U2 = ATMEGA16U2-AUR: Risc Microcontroller, 8-BIT, Flash, AVR Risc Cpu, 16MHZ, Cmos, PQFP32; Manufacturer: Microchip; Interface: SPI; Memory Size: 16KB; Peripherals: Brown-out Detect/Reset; Oscillator Type: Internal; Number of PWM Channels: 4NUMBER; Number of SPI Channels: 1NUMBER; Supplier 1: Digikey; Manufacturer Part Number: ATMEGA16U2-AUR; Category: Microcontrollers; Stock 1: 10661; Pricing 1: 1=3.34, 25=3.06, 100=2.75 (USD); Mount: Surface Mount; Case/Package: TQFP; Min Operating Temperature: -40°C; Max Operating Temperature: 85°C; Packaging: Tape and Reel; Memory Type: FLASH; Core Architecture: AVR; Series: AVR® ATmega; Number of UART Channels: 1NUMBER; Number of USB Channels: 1NUMBER; Height: 1.2mm; RoHS Compliant: Yes; ComponentLink1URL: https://datasheet.ciiva.com/9234/doc7799-9234702.pdf?src-supplier=Avnet; ComponentLink1Description: https://datasheet.ciiva.com/9234/doc7799-9234702.pdf?src-supplier=Avnet; ComponentLink2URL: https://datasheet.octopart.com/ATMEGA16U2-AUR-Microchip-datasheet-13413706.pdf?src-supplier=microchipDIRECT; ComponentLink2Description: https://datasheet.octopart.com/ATMEGA16U2-AUR-Microchip-datasheet-13413706.pdf?src-supplier=microchipDIRECT; ComponentLink3URL: https://datasheet.octopart.com/ATMEGA16U2-AUR-Microchip-datasheet-175858400.pdf?src-supplier=microchipDIRECT; ComponentLink3Description: https://datasheet.octopart.com/ATMEGA16U2-AUR-Microchip-datasheet-175858400.pdf?src-supplier=microchipDIRECT; ComponentLink4URL: https://datasheet.octopart.com/ATMEGA16U2-AUR-Microchip-datasheet-14435305.pdf?src-supplier=Electro+Sonic; ComponentLink4Description: https://datasheet.octopart.com/ATMEGA16U2-AUR-Microchip-datasheet-14435305.pdf?src-supplier=Electro+Sonic; Supplier Part Number 1: ATMEGA16U2-AU
U3 = TL1963A-33DCQR: LDO Regulator Pos 3.3V 1.5A 6-Pin(5+Tab) SOT-223 T/R; Manufacturer: Texas Instruments; Dropout Voltage: 340mV; Number of Outputs: 1; Max Input Voltage: 20V; Min Input Voltage: 2.1V; Min Current Limit: 1.6A; Input Bias Current: 1mA; Polarity: Positive; Accuracy: 3%; Output Type: Fixed; Supplier 1: Mouser; Manufacturer Part Number: TL1963A-33DCQR; RoHS: Yes; Category: Voltage Regulators - Linear; Stock 1: 1905; Pricing 1: 1=3.15, 10=2.72, 50=2.72, 100=2.38, 1000=1.83, 10000=1.61 (USD); Case/Package: SOT-223-6; Number of Pins: 6; Min Operating Temperature: -40°C; Max Operating Temperature: 125°C; Package Quantity: 1; Packaging: Tape and Reel; Output Voltage: 3.3V; Output Current: 1.5A; Max Output Current: 1.5A; Number of Regulators: 1; Quiescent Current: 1mA; Max Output Voltage: 3.3V; Min Output Voltage: 3.3V; Series: -; Radiation Hardening: No; Lead Free: Lead Free; RoHS Compliant: Yes; ComponentLink1URL: https://datasheet.ciiva.com/2046/tl1963a-2046162.pdf?src-supplier=Digikey; ComponentLink1Description: https://datasheet.ciiva.com/2046/tl1963a-2046162.pdf?src-supplier=Digikey; ComponentLink2URL: https://datasheet.ciiva.com/2046/tl1963a-2046161.pdf?src-supplier=Digikey; ComponentLink2Description: https://datasheet.ciiva.com/2046/tl1963a-2046161.pdf?src-supplier=Digikey; ComponentLink3URL: https://datasheet.ciiva.com/2046/tl1963a-2046163.pdf?src-supplier=Digikey; ComponentLink3Description: https://datasheet.ciiva.com/2046/tl1963a-2046163.pdf?src-supplier=Digikey; Supplier Part Number 1: 595-TL1963A-33DCQR
U4-U7 = SN74AHC1G09DBVR: 1-ch, 2-input 2-V to 5.5-V high-speed (9 ns) AND gate with open-drain outputs 5-SOT-23 -55 to 125; Manufacturer: Texas Instruments; Min Supply Voltage: 2V; Max Supply Voltage: 5.5V; Quiescent Current: 1uA; Number of Inputs: 2; Propagation Delay: 7.5ns; Output Current: 25mA; Number of Outputs: 1; Low Level Output Current: 8mA; Number of Channels: 1NUMBER; Supplier 1: Mouser; Manufacturer Part Number: SN74AHC1G09DBVR; RoHS: Yes; Category: Logic Gates; Stock 1: 6036; Pricing 1: 1=0.32, 10=0.187, 50=0.187, 100=0.095, 1000=0.07, 10000=0.05 (USD); Mount: Surface Mount; Case/Package: SOT-23; Number of Pins: 5; Min Operating Temperature: -55°C; Max Operating Temperature: 125°C; Logic Function: AND GATE; Output Voltage: 5.5V; Package Quantity: 3000; Packaging: Tape and Reel; Number of Circuits: 1; Number of Gates: 1; Number of Elements: 1; Number of Bits: 1; Series: 74AHC; Technology: CMOS; Nominal Supply Current: 1uA; Length: 2.9mm; Width: 1.6mm; Height: 1.45mm; Thickness: 1.2mm; Radiation Hardening: No; Reach SVHC Compliant: No; Lead Free: Lead Free; RoHS Compliant: Yes; ComponentLink1URL: https://datasheet.ciiva.com/1864/sn74ahc1g09-1864411.pdf?src-supplier=Digikey; ComponentLink1Description: https://datasheet.ciiva.com/1864/sn74ahc1g09-1864411.pdf?src-supplier=Digikey; ComponentLink2URL: https://datasheet.ciiva.com/1864/sn74ahc1g09-1864410.pdf?src-supplier=Digikey; ComponentLink2Description: https://datasheet.ciiva.com/1864/sn74ahc1g09-1864410.pdf?src-supplier=Digikey; ComponentLink3URL: https://datasheet.ciiva.com/1864/sn74ahc1g09-1864412.pdf?src-supplier=Digikey; ComponentLink3Description: https://datasheet.ciiva.com/1864/sn74ahc1g09-1864412.pdf?src-supplier=Digikey; Supplier Part Number 1: 595-SN74AHC1G09DBVR
Y1 Y2 = ABM7-16.000MHZ-D2Y-T: Crystal 16MHz ±20ppm (Tol) ±30ppm (Stability) 18pF FUND 50Ohm 2-Pin Mini-CSMD T/R; Manufacturer: Abracon; Supplier 1: Rs; Manufacturer Part Number: ABM7-16.000MHZ-D2Y-T; RoHS: Yes; Category: Crystals; Stock 1: 2970; ComponentLink1URL: https://datasheet.ciiva.com/15116/getdatasheetpartid-721624-15116835.pdf?src-supplier=Verical; ComponentLink1Description: https://datasheet.ciiva.com/15116/getdatasheetpartid-721624-15116835.pdf?src-supplier=Verical; ComponentLink2URL: https://datasheet.ciiva.com/16383/abm7-16383174.pdf?src-supplier=Future+Electronics; ComponentLink2Description: https://datasheet.ciiva.com/16383/abm7-16383174.pdf?src-supplier=Future+Electronics; ComponentLink3URL: https://datasheet.ciiva.com/7998/947971-7998600.pdf?src-supplier=Element14; ComponentLink3Description: https://datasheet.ciiva.com/7998/947971-7998600.pdf?src-supplier=Element14; ComponentLink4URL: https://datasheet.ciiva.com/46385/947971-46385243.pdf?src-supplier=Element14; ComponentLink4Description: https://datasheet.ciiva.com/46385/947971-46385243.pdf?src-supplier=Element14; ComponentLink5URL: https://datasheet.ciiva.com/22658/947971-22658293.pdf?src-supplier=Element14; ComponentLink5Description: https://datasheet.ciiva.com/22658/947971-22658293.pdf?src-supplier=Element14; ComponentLink6URL: https://datasheet.ciiva.com/26941/getdatasheetpartid-719818-26941724.pdf?src-supplier=Verical; ComponentLink6Description: https://datasheet.ciiva.com/26941/getdatasheetpartid-719818-26941724.pdf?src-supplier=Verical; ComponentLink7URL: https://datasheet.ciiva.com/18649/abm7-18649865.pdf?src-supplier=Digikey; ComponentLink7Description: https://datasheet.ciiva.com/18649/abm7-18649865.pdf?src-supplier=Digikey; ComponentLink8URL: https://datasheet.ciiva.com/18649/abm7-18649866.pdf?src-supplier=Digikey; ComponentLink8Description: https://datasheet.ciiva.com/18649/abm7-18649866.pdf?src-supplier=Digikey; ComponentLink9URL: https://datasheet.ciiva.com/18649/abm7-18649867.pdf?src-supplier=Digikey; ComponentLink9Description: https://datasheet.ciiva.com/18649/abm7-18649867.pdf?src-supplier=Digikey; ComponentLink10URL: https://datasheet.ciiva.com/5788/abm7-5788054.pdf?src-supplier=Farnell; ComponentLink10Description: https://datasheet.ciiva.com/5788/abm7-5788054.pdf?src-supplier=Farnell; Supplier Part Number 1: 1710633P
Z1 Z2 = CG0603MLC-05E: ESD Suppressor Multilayer Varistor 5V Automotive 2-Pin Case 0603(1608Metric) T/R; Manufacturer: Bourns; Capacitance: 0.5pF; Voltage Rating (AC): 8V; Number of Channels: 1; Clamping Voltage: 20V; Current Rating: 50nA; Supplier 1: Rs; Manufacturer Part Number: CG0603MLC-05E; RoHS: Yes; Category: Varistors; Stock 1: 2750; Case/Package: 0603; Number of Pins: 2; Case Code (Imperial): 0603; Case Code (Metric): 1608; Contact Plating: Tin; Min Operating Temperature: -40°C; Max Operating Temperature: 85°C; Voltage Rating (DC): 5V; Operating Supply Voltage: 5V; Package Quantity: 1; Packaging: Tape and Reel; Termination: SMD/SMT; Voltage: 5V; Number of Circuits: 1; Max Voltage Rating (DC): 5V; Working Voltage: 5V; Leakage Current: 50nA; Series: MLC; Length: 1.6mm; Width: 0.8mm; Depth: 0.8mm; Thickness: 0.8mm; Radiation Hardening: No; Reach SVHC Compliant: No; RoHS Compliant: Yes; ComponentLink1URL: https://datasheet.ciiva.com/8084/mlc-8084047.pdf?src-supplier=Avnet; ComponentLink1Description: https://datasheet.ciiva.com/8084/mlc-8084047.pdf?src-supplier=Avnet; Supplier Part Number 1: 1814489